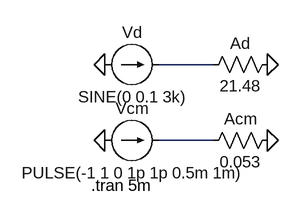
[diagram p0: schematic lab6.2predrawing.asc]
lab6.2predrawing.asc, the LTspice schematic file:
Version 4
SHEET 1 880 680
WIRE 288 160 208 160
WIRE 288 272 208 272
FLAG 128 160 0
FLAG 128 272 0
FLAG 368 272 0
FLAG 368 160 0
SYMBOL current 128 160 R270
WINDOW 0 32 40 VTop 2
WINDOW 3 -32 40 VBottom 2
WINDOW 123 0 0 Left 0
WINDOW 39 0 0 Left 0
SYMATTR InstName Vd
SYMATTR Value SINE(0 0.1 3k)
SYMBOL current 128 272 R270
WINDOW 0 32 40 VTop 2
WINDOW 3 -32 40 VBottom 2
WINDOW 123 0 0 Left 0
WINDOW 39 0 0 Left 0
SYMATTR InstName Vcm
SYMATTR Value PULSE(-1 1 0 1p 1p 0.5m 1m)
SYMBOL res 384 144 R90
WINDOW 0 0 56 VBottom 2
WINDOW 3 32 56 VTop 2
SYMATTR InstName Ad
SYMATTR Value 21.48
SYMBOL res 384 256 R90
WINDOW 0 0 56 VBottom 2
WINDOW 3 32 56 VTop 2
SYMATTR InstName Acm
SYMATTR Value 0.053
TEXT 108 338 Left 2 !.tran 5m

The netlist it stands for:
* lab6.2predrawing.asc
I§Vd 0 N001 SINE(0 0.1 3k)
I§Vcm 0 N002 PULSE(-1 1 0 1p 1p 0.5m 1m)
R§Ad 0 N001 21.48
R§Acm 0 N002 0.053
.tran 5m
.backanno
.end